# Altium schematic sheet MCU_Master.SCHDOC
size A; Organization: Altium Limited; Address1: L3, 12a Rodborough Rd; Address2: Frenchs Forest; Address3: NSW; Address4: Australia 2086; DocumentNumber: 5; SheetNumber: 5; SheetTotal: 8
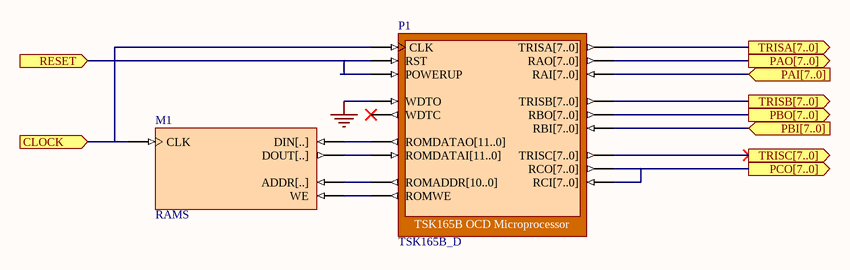
[diagram p0: MCU_Master.SCHDOC]

## Parts
M1  RAMS
P1  TSK165B_D

## Ports
CLOCK (in), PAI[7..0] (in), PAO[7..0] (out), PBI[7..0] (in), PBO[7..0] (out), PCO[7..0] (out), RESET (in), TRISA[7..0] (out), TRISB[7..0] (out), TRISC[7..0] (out)

## Nets
GND: P1.WDTO
CLOCK: M1.CLK P1.CLK ; port CLOCK
PAI[7..0]: P1.RAI[7..0] ; port PAI[7..0]
PAO[7..0]: P1.RAO[7..0] ; port PAO[7..0]
PBI[7..0]: P1.RBI[7..0] ; port PBI[7..0]
PBO[7..0]: P1.RBO[7..0] ; port PBO[7..0]
PCO[7..0]: P1.RCI[7..0] P1.RCO[7..0] ; port PCO[7..0]
RESET: P1.POWERUP P1.RST ; port RESET
TRISA[7..0]: P1.TRISA[7..0] ; port TRISA[7..0]
TRISB[7..0]: P1.TRISB[7..0] ; port TRISB[7..0]
TRISC[7..0]: P1.TRISC[7..0] ; port TRISC[7..0]
NetM1_ADDR[..]: M1.ADDR[..] P1.ROMADDR[10..0]
NetM1_DIN[..]: M1.DIN[..] P1.ROMDATAO[11..0]
NetM1_DOUT[..]: M1.DOUT[..] P1.ROMDATAI[11..0]
NetM1_WE: M1.WE P1.ROMWE

Not connected (* = marked no-connect by the designer): P1 WDTC*

## Notes on the sheet
- Title
- Size:
- Date:
- A
- Number:
- Time:
- Revision:
- Sheet
- of
- File:

## Library data of the parts
M1 = RAMS: Single Port Random Access Memory; Memory_Depth: DefinedBy=ADDR; Memory_Type: RAM_SinglePortBlock; Memory_Width: DefinedBy=DIN; Memory_ClockEdge: Rising; Nexus_Core: Memory_Program; ArchiveName: GENERIC; VHDLIB_SIM: GENERIC_LIB; Published: 29-Jan-2004; Publisher: Altium Limited; Core Revision: 1.00.00
P1 = TSK165B_D: TSK165B OCD Microprocessor; NEXUS_CORE: Processor_OCDS; NEXUS_JTAG_DEVICE: True; NEXUS_JTAG_ORDER: 0; ChildModel1: TSK165B_D_RAM128x8; ChildCore1: M1; Memory_Configuration: Record[NEXUS_CORE]{}ComponentDesignator[xram]{}Memory_Depth[128]{}Memory_UsageType[ram]{}ProgramDownloadAddress[0x0]{}Memory_BusType[c165x:data_bus]{n}Record[NEXUS_CORE]{}ComponentDesignator[xrom]{}Memory_Depth[2k]{}Memory_UsageType[rom]{}ProgramDownloadAddress[0x0]{}Memory_BusType[c165x:code_bus]{}Memory_Mau[12]{n}; Published: 1/12/2003; Publisher: Altium Hobart Technology Centre; Core Revision: 1.00.00